# EAGLE schematic Motor Controller2. (EAGLE 9.6.2)
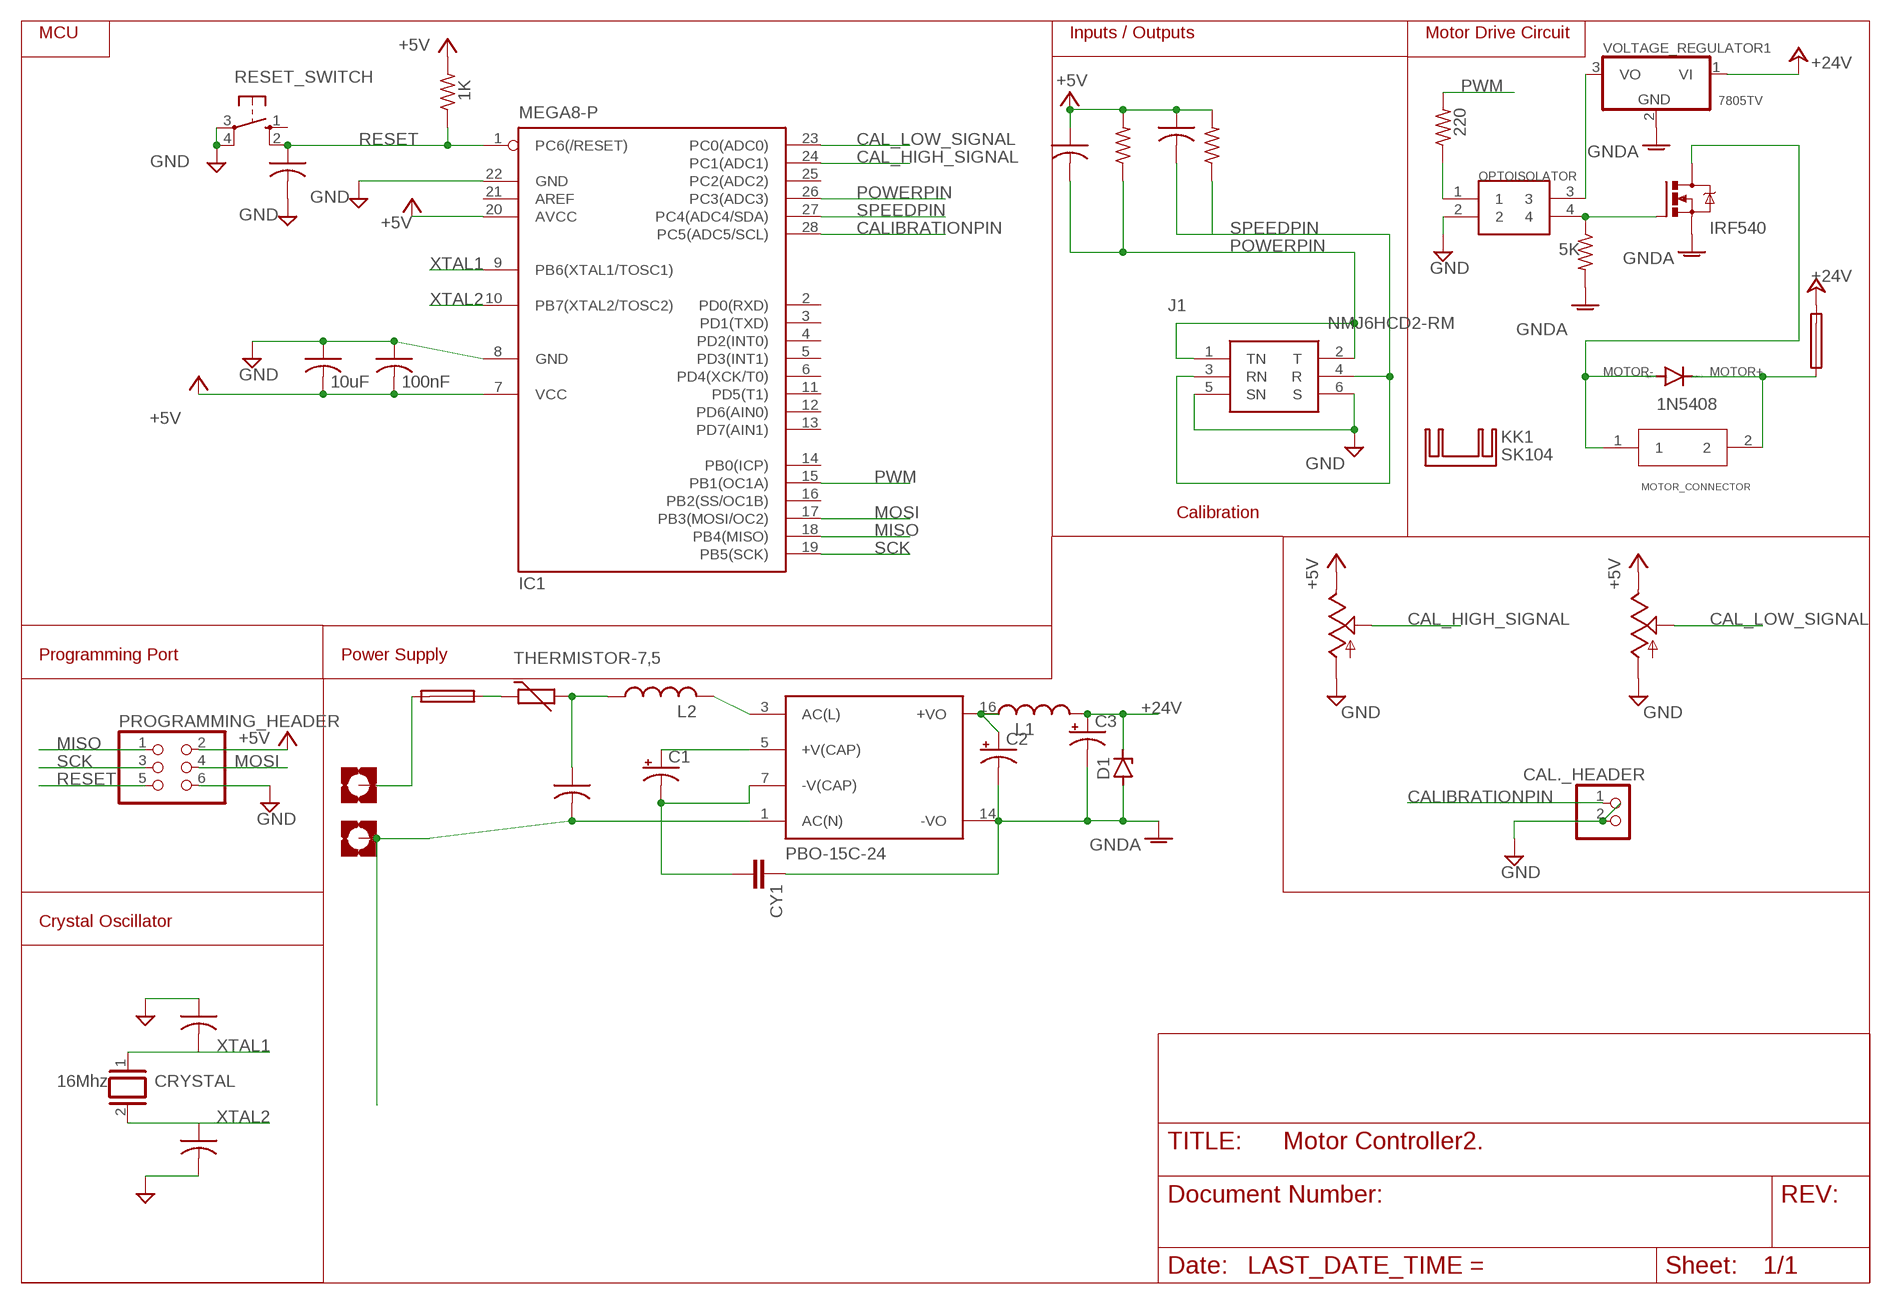
[diagram p0: schematic, sheet 1]

## Parts
1N5408  1N5408  1N5400  [DO201-15]
C1  CPOL-USE5-13  [E5-13]
C2  CPOL-USE5-10.5  [E5-10,5]
C3  CPOL-USE5-10.5  [E5-10,5]
C4  C-US150-091X182  [C150-091X182]
C6  C-US025-024X044  [C025-024X044]
C10  C-US025-024X044  [C025-024X044]
C11  C-US025-024X044  [C025-024X044]
C12  C-US025-024X044  [C025-024X044]
C13  10uF  C-US025-024X044  [C025-024X044]
C14  100nF  C-US025-024X044  [C025-024X044]
C15  C-US025-024X044  [C025-024X044]
CAL._HEADER  PINHD-1X2  [1X02]
CRYSTAL  16Mhz  XTAL/S  [QS]
CY1  CYYC10B4  [YC10B4]
D1  ZENER-DIODEZD-7.5  [ZDIO-7.5]
F1  FUSESH22,5  [SH22,5]
F2  FUSESH22,5  [SH22,5]
FAST  TRIM_US-CT6  [CT6]
H1  MOUNT-PAD-SQUARE3.6  [3,6-PAD-SQUARE]
H2  MOUNT-PAD-SQUARE3.6  [3,6-PAD-SQUARE]
IC1  MEGA8-P  [DIL28-3]
J1  NMJ6HCD2-RM  [NMJ6HCD2RM]
KK1  SK104  [SK104]
L1  L-USTJ5-U1  [TJ5-U1]
L2  L-US6000-XXX-RC  [6000-XXXX-RC]
MOTOR_CONNECTOR  641963-1  [641963-1_TYC]
OPTOISOLATOR  SFH619A  SFH619A-ND  [SFH619A]
PROGRAMMING_HEADER  PINHD-2X3  [2X03]
PS1  PBO-15C-24  [CONV_PBO-15C-24]
Q1  IRF540  [TO220BV]
R1  THERMISTOR-7,5  [R-7,5]
R2  1K  R-US_0204/7  [0204/7]
R3  R-US_0204/7  [0204/7]
R5  220  R-US_0204/7  [0204/7]
R6  5K  R-US_0204/7  [0204/7]
R7  R-US_0204/7  [0204/7]
RESET_SWITCH  10-XX  [B3F-10XX]
SLOW  TRIM_US-CT6  [CT6]
VOLTAGE_REGULATOR1  7805TV  [TO220V]

## Nets
+5V: C10.1 C12.1 C13.2 C14.2 FAST.E IC1.7(VCC) IC1.20(AVCC) PROGRAMMING_HEADER.2 R2.2 R3.2 R7.2 SLOW.E
+24V: C3.+ D1.C F1.2 L1.2 VOLTAGE_REGULATOR1.1(VI)
AC(L): L2.2 PS1.3(AC(L))
CAL_HIGH_SIGNAL: FAST.S IC1.24(PC1(ADC1))
CAL_LOW_SIGNAL: IC1.23(PC0(ADC0)) SLOW.S
CALIBRATIONPIN: CAL._HEADER.1 IC1.28(PC5(ADC5/SCL))
GND: C6.2 C11.2 C13.1 C14.1 C15.1 CAL._HEADER.2 FAST.A IC1.8(GND) IC1.22(GND) J1.5(SN) J1.6(S) OPTOISOLATOR.2 PROGRAMMING_HEADER.6 RESET_SWITCH.3(P) RESET_SWITCH.4(P1) SLOW.A
GNDA: C2.- C3.- CY1.1 D1.A PS1.14(-VO) Q1.S R6.2 VOLTAGE_REGULATOR1.2(GND)
MISO: IC1.18(PB4(MISO)) PROGRAMMING_HEADER.1
MOSI: IC1.17(PB3(MOSI/OC2)) PROGRAMMING_HEADER.4
MOTOR+: 1N5408.C F1.1 MOTOR_CONNECTOR.2
MOTOR-: 1N5408.A MOTOR_CONNECTOR.1 Q1.D
N$1: OPTOISOLATOR.1 R5.1
N$2: OPTOISOLATOR.4 Q1.G R6.1
N$3: OPTOISOLATOR.3 VOLTAGE_REGULATOR1.3(VO)
N$4: C2.+ L1.1 PS1.16(+VO)
N$5: C1.+ PS1.5(+V(CAP))
N$6: C1.- CY1.2 PS1.7(-V(CAP))
N$7: C4.2 H2.B3,6(MOUNT) PS1.1(AC(N))
N$8: F2.2 H1.B3,6(MOUNT)
N$9: F2.1 R1.1
N$10: C4.1 L2.1 R1.2
POWERPIN: C10.2 IC1.26(PC3(ADC3)) J1.1(TN) J1.2(T) R3.1
PWM: IC1.15(PB1(OC1A)) R5.2
RESET: C11.1 IC1.1(PC6(/RESET)) PROGRAMMING_HEADER.5 R2.1 RESET_SWITCH.2(S1)
SCK: IC1.19(PB5(SCK)) PROGRAMMING_HEADER.3
SPEEDPIN: C12.2 IC1.27(PC4(ADC4/SDA)) J1.3(RN) J1.4(R) R7.1
XTAL1: C15.2 CRYSTAL.1 IC1.9(PB6(XTAL1/TOSC1))
XTAL2: C6.1 CRYSTAL.2 IC1.10(PB7(XTAL2/TOSC2))
Unconnected: IC1.2(PD0(RXD)) IC1.3(PD1(TXD)) IC1.4(PD2(INT0)) IC1.5(PD3(INT1)) IC1.6(PD4(XCK/T0)) IC1.11(PD5(T1)) IC1.12(PD6(AIN0)) IC1.13(PD7(AIN1)) IC1.14(PB0(ICP)) IC1.16(PB2(SS/OC1B)) IC1.21(AREF) IC1.25(PC2(ADC2)) RESET_SWITCH.1(S)

## Notes on the sheet
- MCU | Inputs / Outputs | Motor Drive Circuit
- Calibration
- Programming Port | Power Supply
- Crystal Oscillator

## Library data of the parts
1N5408 = diode:1N5400: DIODE standard rectifier, 3 A, 50 V (Motorola)
C1-C3 = rcl:CPOL-US: POLARIZED CAPACITOR, American symbol; SPICEPREFIX: C
C4 C6 C10-C15 = rcl:C-US: CAPACITOR, American symbol; SPICEPREFIX: C
CAL._HEADER = pinhead:PINHD-1X2: PIN HEADER
CRYSTAL = special:XTAL/S: CRYSTAL
CY1 = rcl:CY: Y CAPACITOR for power line; SPICEPREFIX: C
D1 = diode:ZENER-DIODE: Z-Diode
F1 F2 = fuse:FUSE: Fuse; OC_FARNELL: unknown; OC_NEWARK: unknown
FAST SLOW = pot:TRIM_US-: POTENTIOMETER
H1 H2 = holes:MOUNT-PAD-SQUARE: MOUNTING PAD, square
IC1 = atmel:MEGA8-P: MICROCONTROLLER 8 Kbytes FLASH, 1 kbytes SRAM, 512 bytes EEPROM, USART, 4-channel 10 bit ADC, 2-channel 8 bit ADC Pin compatible with Atmega48, ATMega88, ATMega168 Source: avr.lbr; OC_FARNELL: unknown; OC_NEWARK: unknown
J1 = SamacSys_Parts:NMJ6HCD2-RM: NMJ6HCD2-RM Phone Connectors 1/4" STERO JCK SWTCH FULL TRD NSE PC HORZ Source: Datasheet <https://www.mouser.com/datasheet/2/289/st-nmj6hcd2-1842677.pdf>; DESCRIPTION: NMJ6HCD2-RM Phone Connectors 1/4" STERO JCK SWTCH FULL TRD NSE PC HORZ; HEIGHT: 15.67mm; MANUFACTURER_NAME: Neutrik; MANUFACTURER_PART_NUMBER: NMJ6HCD2-RM; MOUSER_PART_NUMBER: 568-NMJ6HCD2-RM; MOUSER_PRICE-STOCK: https://www.mouser.co.uk/ProductDetail/Neutrik/NMJ6HCD2-RM?qs=%252B86TLfaev28zLpqKj2fOGg%3D%3D
KK1 = heatsink:SK104: HEATSINK manufacturer Fischer/distributor Buerklin
L1 L2 = rcl:L-US: INDUCTOR, American symbol; SPICEPREFIX: L
MOTOR_CONNECTOR = Benson:641963-1; BUILT_BY: EMA_UL_Team; MANUFACTURER_PART_NUMBER: 641963-1; SOURCELIBRARY: Tyco_2012-04-26; VENDOR: TE Connectivity
OPTOISOLATOR = Benson:SFH619A-ND; OPTOISOLATOR: SFH619A
PROGRAMMING_HEADER = pinhead:PINHD-2X3: PIN HEADER
PS1 = PBO-15C-24:PBO-15C-24: Check prices <https://pricing.snapeda.com/parts/PBO-15C-24/CUI%20Inc./view-part?ref=eda>; AVAILABILITY: Warning; CUI_PURCHASE_URL: https://www.cui.com/product/internal-ac-dc-power-supplies/board-mount/pbo-15c-series?utm_source=snapeda.com&utm_medium=referral&utm_campaign=snapedaBOM; DESCRIPTION: 15 W, 85 ~ 305 Vac Input, Single Output, Open Frame, Board Mount, Ac-Dc Power Supply; MF: CUI Inc.; MP: PBO-15C-24; PACKAGE: None; PRICE: None; PURCHASE-URL: https://pricing.snapeda.com/search/part/PBO-15C-24/?ref=eda
Q1 = transistor-power:IRF540: HEXFET Power MOSFET
R1 = varistor:THERMISTOR: THERMISTOR
R2 R3 R5-R7 = rcl:R-US_: RESISTOR, American symbol; SPICEPREFIX: R
RESET_SWITCH = switch-omron:10-XX: OMRON SWITCH; MPN: B3F-1000; OC_FARNELL: 176432; OC_NEWARK: 36M3542
VOLTAGE_REGULATOR1 = linear:78*: Positive VOLTAGE REGULATOR Source: http://cache.national.com/ds/LM/LM78L05.pdf http://www.fairchildsemi.com/ds/LM/LM7805.pdf